# EAGLE design rpi (EAGLE 6.4)
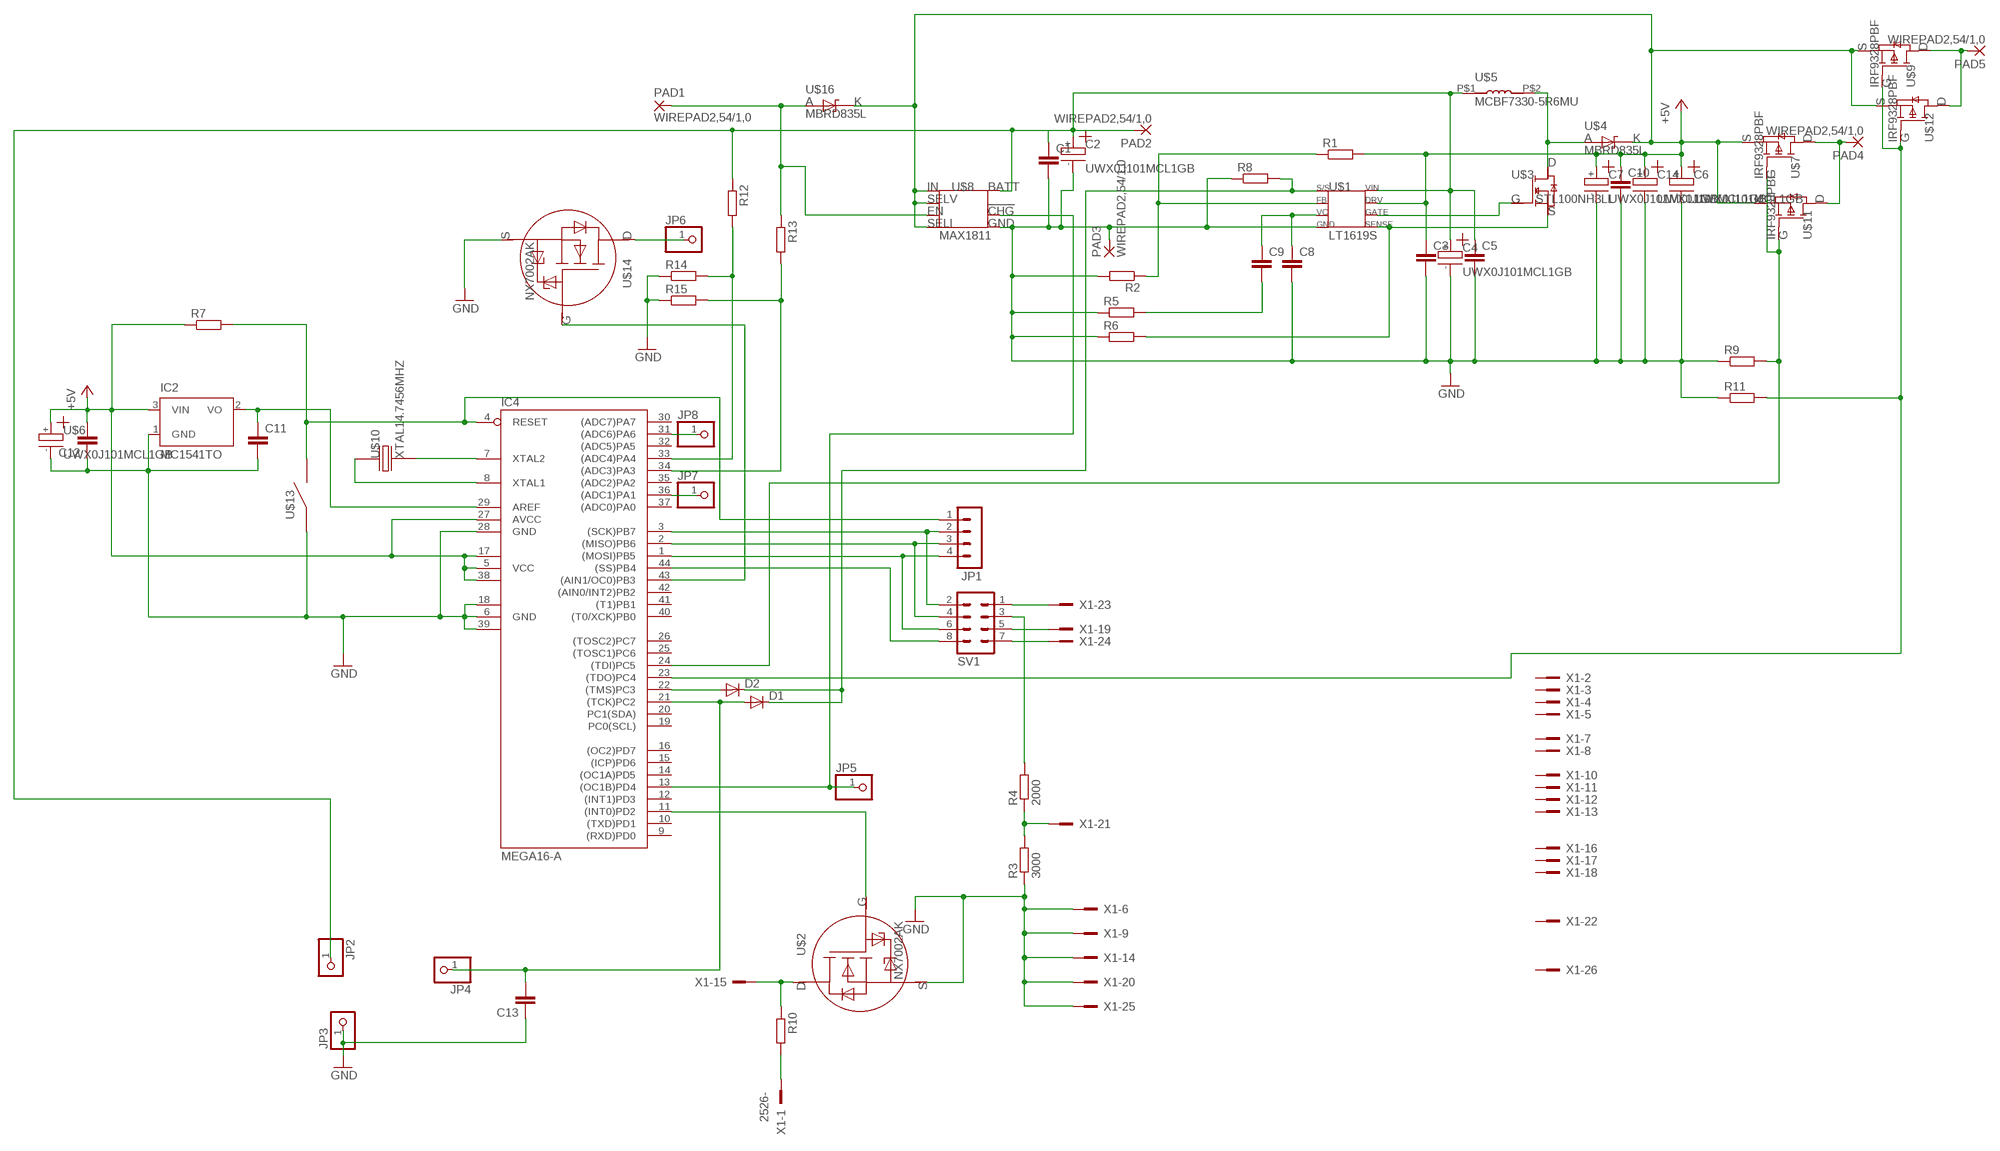
[diagram p0: schematic, sheet 1]

## Parts
C1  C-EUC1206  [C1206]
C2  UWX0J101MCL1GB  [UWX0J101MCL1GB]
C3  C-EUC1206  [C1206]
C4  UWX0J101MCL1GB  [UWX0J101MCL1GB]
C5  C-EUC1206  [C1206]
C6  UWX0J101MCL1GB  [UWX0J101MCL1GB]
C7  UWX0J101MCL1GB  [UWX0J101MCL1GB]
C8  C-EUC1206  [C1206]
C9  C-EUC1206  [C1206]
C10  C-EUC1206  [C1206]
C11  C-EUC1206  [C1206]
C12  C-EUC1206  [C1206]
C13  C-EUC1206  [C1206]
C14  UWX0J101MCL1GB  [UWX0J101MCL1GB]
D1  DIODE-MINIMELF  [MINIMELF]
D2  DIODE-MINIMELF  [MINIMELF]
IC2  MC1541TO  [TO92]
IC4  MEGA16-A  [TQFP44]
JP1  MA04-1  [MA04-1]
JP2  PINHD-1X1  [1X01]
JP3  PINHD-1X1  [1X01]
JP4  PINHD-1X1  [1X01]
JP5  PINHD-1X1  [1X01]
JP6  PINHD-1X1  [1X01]
JP7  PINHD-1X1  [1X01]
JP8  PINHD-1X1  [1X01]
PAD1  WIREPAD2,54/1,0  [2,54/1,0]
PAD2  WIREPAD2,54/1,0  [2,54/1,0]
PAD3  WIREPAD2,54/1,0  [2,54/1,0]
PAD4  WIREPAD2,54/1,0  [2,54/1,0]
PAD5  WIREPAD2,54/1,0  [2,54/1,0]
R1  R-EU_R1206  [R1206]
R2  R-EU_R1206  [R1206]
R3  3000  R-EU_R1206  [R1206]
R4  2000  R-EU_R1206  [R1206]
R5  R-EU_R1206  [R1206]
R6  R-EU_R1206  [R1206]
R7  R-EU_R1206  [R1206]
R8  R-EU_R1206  [R1206]
R9  R-EU_R1206  [R1206]
R10  R-EU_R1206  [R1206]
R11  R-EU_R1206  [R1206]
R12  R-EU_R1206  [R1206]
R13  R-EU_R1206  [R1206]
R14  R-EU_R1206  [R1206]
R15  R-EU_R1206  [R1206]
SV1  MA04-2  [MA04-2]
U$1  LT1619S  [SO8]
U$2  NX7002AK  [SOT23]
U$3  STL100NH3LL  [POWERFLAT6X5]
U$4  MBRD835L  [DPAK]
U$5  MCBF7330-5R6MU  [MCBF7330-5R6MU]
U$6  UWX0J101MCL1GB  [UWX0J101MCL1GB]
U$7  IRF9328PBF  [SO8]
U$8  MAX1811  [SO8]
U$9  IRF9328PBF  [SO8]
U$10  XTAL14.7456MHZ  [HC49-SMD]
U$11  IRF9328PBF  [SO8]
U$12  IRF9328PBF  [SO8]
U$13  TLACITKO  [TLACITKO]
U$14  NX7002AK  [SOT23]
U$16  MBRD835L  [DPAK]
X1  2526-  [PAK100/2500-26]

## Nets
+5V: C3.1 C6.+ C7.+ C10.1 C12.2 C14.+ IC2.3(VIN) IC4.5(VCC) IC4.17(VCC1) IC4.27(AVCC) IC4.38(VCC2) R1.2 R7.1 U$1.D2(DRV) U$4.4(K) U$6.+ U$7.S U$7.S2(S) U$7.S3(S) U$8.G(IN) U$8.S2(SELI) U$8.S(SELV) U$9.S U$9.S2(S) U$9.S3(S) U$11.S U$11.S2(S) U$11.S3(S) U$12.S U$12.S2(S) U$12.S3(S) U$16.4(K)
AREF: C11.1 IC2.2(VO) IC4.29(AREF)
GND: C1.2 C2.- C3.2 C4.- C5.2 C6.- C7.- C8.2 C10.2 C11.2 C12.1 C13.1 C14.- IC2.1(GND) IC4.6(GND) IC4.18(GND1) IC4.28(GND) IC4.39(GND2) JP3.1 PAD3.1(P) R2.2 R3.1 R5.1 R6.1 R8.1 R9.1 R11.1 R14.1 R15.1 U$1.G(GND) U$2.S U$6.- U$8.D3(GND) U$8.S3(GND) U$13.P$1 U$13.P$3 U$14.S X1.6 X1.9 X1.14 X1.20 X1.25
N$1: R3.2 R4.1 X1.21
N$2: IC4.34((ADC3)PA3) R13.2 R15.2
N$3: D2.A IC4.22((TMS)PC3)
N$4: R4.2 SV1.3
N$5: SV1.7 X1.24
N$6: IC4.11((INT0)PD2) U$2.G
N$7: R10.2 X1.1
N$8: R10.1 U$2.D X1.15
N$9: IC4.43((AIN1/OC0)PB3) U$14.G
N$10: JP6.1 U$14.D
N$11: IC4.36((ADC1)PA1) JP7.1
N$12: R1.1 R2.1 U$1.S2(FB)
N$13: R6.2 U$1.D4(SENSE) U$3.1(S) U$3.2(S) U$3.3(S)
N$14: IC4.31((ADC6)PA6) JP8.1
N$15: IC4.24((TDI)PC5) R9.2 U$7.G U$11.G
N$16: IC4.33((ADC4)PA4) R12.2 R14.2
N$17: PAD1.1(P) R13.1 U$8.D2(EN) U$16.1(A) U$16.3(A)
N$18: U$1.D3(GATE) U$3.4(G)
N$19: C13.2 D1.A IC4.21((TCK)PC2) JP4.1
N$20: PAD4.1(P) U$7.D U$7.D2(D) U$7.D3(D) U$7.D4(D) U$11.D U$11.D2(D) U$11.D3(D) U$11.D4(D)
N$21: SV1.5 X1.19
N$22: SV1.1 X1.23
N$23: U$3.5(D) U$4.1(A) U$4.3(A) U$5.P$2
N$25: C9.2 R5.2
N$26: C8.1 C9.1 U$1.S3(VC)
N$29: PAD5.1(P) U$9.D U$9.D2(D) U$9.D3(D) U$9.D4(D) U$12.D U$12.D2(D) U$12.D3(D) U$12.D4(D)
PA3: C1.1 C2.+ C4.+ C5.1 JP2.1 PAD2.1(P) R12.1 U$1.D(VIN) U$5.P$1 U$8.D4(BATT)
PB4: IC4.44((SS)PB4) SV1.8
PB5: IC4.1((MOSI)PB5) JP1.4 SV1.6
PB6: IC4.2((MISO)PB6) JP1.3 SV1.4
PC3: D1.C D2.C R8.2 U$1.S(S/S)
PC4: IC4.23((TDO)PC4) R11.2 U$9.G U$12.G
PD5: IC4.13((OC1B)PD4) JP5.1 U$8.D(!CHG)
RESET: IC4.4(RESET) JP1.1 R7.2 U$13.P$2 U$13.P$4
SCK: IC4.3((SCK)PB7) JP1.2 SV1.2
XTAL1: IC4.8(XTAL1) U$10.P$1
XTAL2: IC4.7(XTAL2) U$10.P$2
Unconnected: IC4.9((RXD)PD0) IC4.10((TXD)PD1) IC4.12((INT1)PD3) IC4.14((OC1A)PD5) IC4.15((ICP)PD6) IC4.16((OC2)PD7) IC4.19(PC0(SCL)) IC4.20(PC1(SDA)) IC4.25((TOSC1)PC6) IC4.26((TOSC2)PC7) IC4.30((ADC7)PA7) IC4.32((ADC5)PA5) IC4.35((ADC2)PA2) IC4.37((ADC0)PA0) IC4.40((T0/XCK)PB0) IC4.41((T1)PB1) IC4.42((AIN0/INT2)PB2) X1.2 X1.3 X1.4 X1.5 X1.7 X1.8 X1.10 X1.11 X1.12 X1.13 X1.16 X1.17 X1.18 X1.22 X1.26

## Library data of the parts
C1 C3 C5 C8-C13 = rcl:C-EU: CAPACITOR, European symbol
C2 C4 C6 C7 C14 U$6 = tablet:UWX0J101MCL1GB
D1 D2 = diode:DIODE-: DIODE
IC2 = microchip:MC15*: 2.5V and 4.096V Voltage References Source: http://www.microchip.com .. 21653b.pdf; OC_FARNELL: unknown; OC_NEWARK: unknown
IC4 = atmel:MEGA16: MICROCONTROLLER 16 Kbytes FLASH 1 kbytes SRAM 512 bytes EEPROM USART 8-channel 10 bit ADC Source: avr.lbr; MPN: ATMEGA16-16AU; OC_FARNELL: 9171134; OC_NEWARK: 96K6515
JP1 = tablet:MA04-1: PIN HEADER; OC_FARNELL: unknown; OC_NEWARK: unknown
JP2-JP8 = pinhead:PINHD-1X1: PIN HEADER
PAD1-PAD5 = wirepad:WIREPAD: Wire PAD connect wire on PCB
R1 R2 R5-R15 = rcl:R-EU_: RESISTOR, European symbol
R3 R4 = resistor:R-EU_: RESISTOR, European symbol
SV1 = tablet:MA04-2: PIN HEADER; OC_FARNELL: unknown; OC_NEWARK: unknown
U$1 = tablet:LT1619
U$2 U$14 = tablet:NX7002AK
U$3 = tablet:STL100NH3LL
U$4 U$16 = tablet:MBRD835L
U$5 = tablet:MCBF7330-5R6MU
U$7 U$9 U$11 U$12 = tablet:IRF9328PBF
U$8 = tablet:MAX1811
U$10 = tablet:XTAL14.7456MHZ
U$13 = tablet:TLACITKO
X1 = tablet:2526-: 3M (TM) Pak 100 4-Wall Header Source: 3M; OC_FARNELL: unknown; OC_NEWARK: unknown

## Net classes
0 default: clearance 0.355 mm

## Board
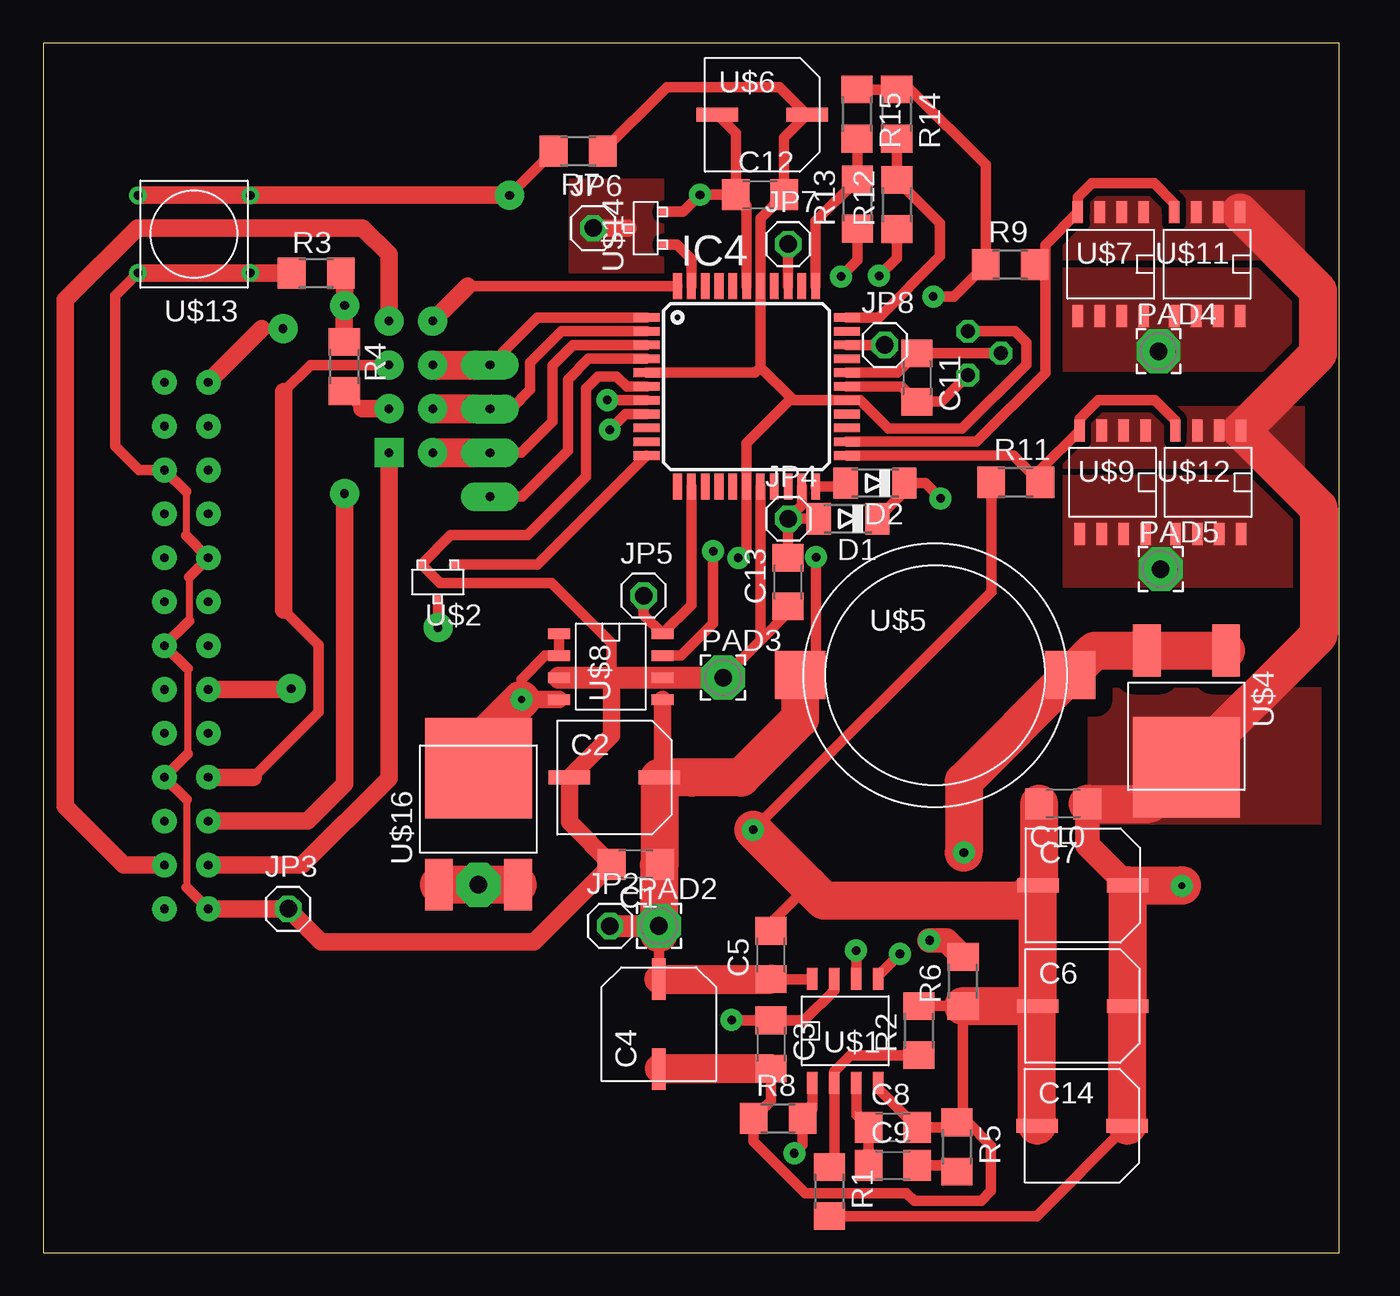
[diagram p1: board, top side]
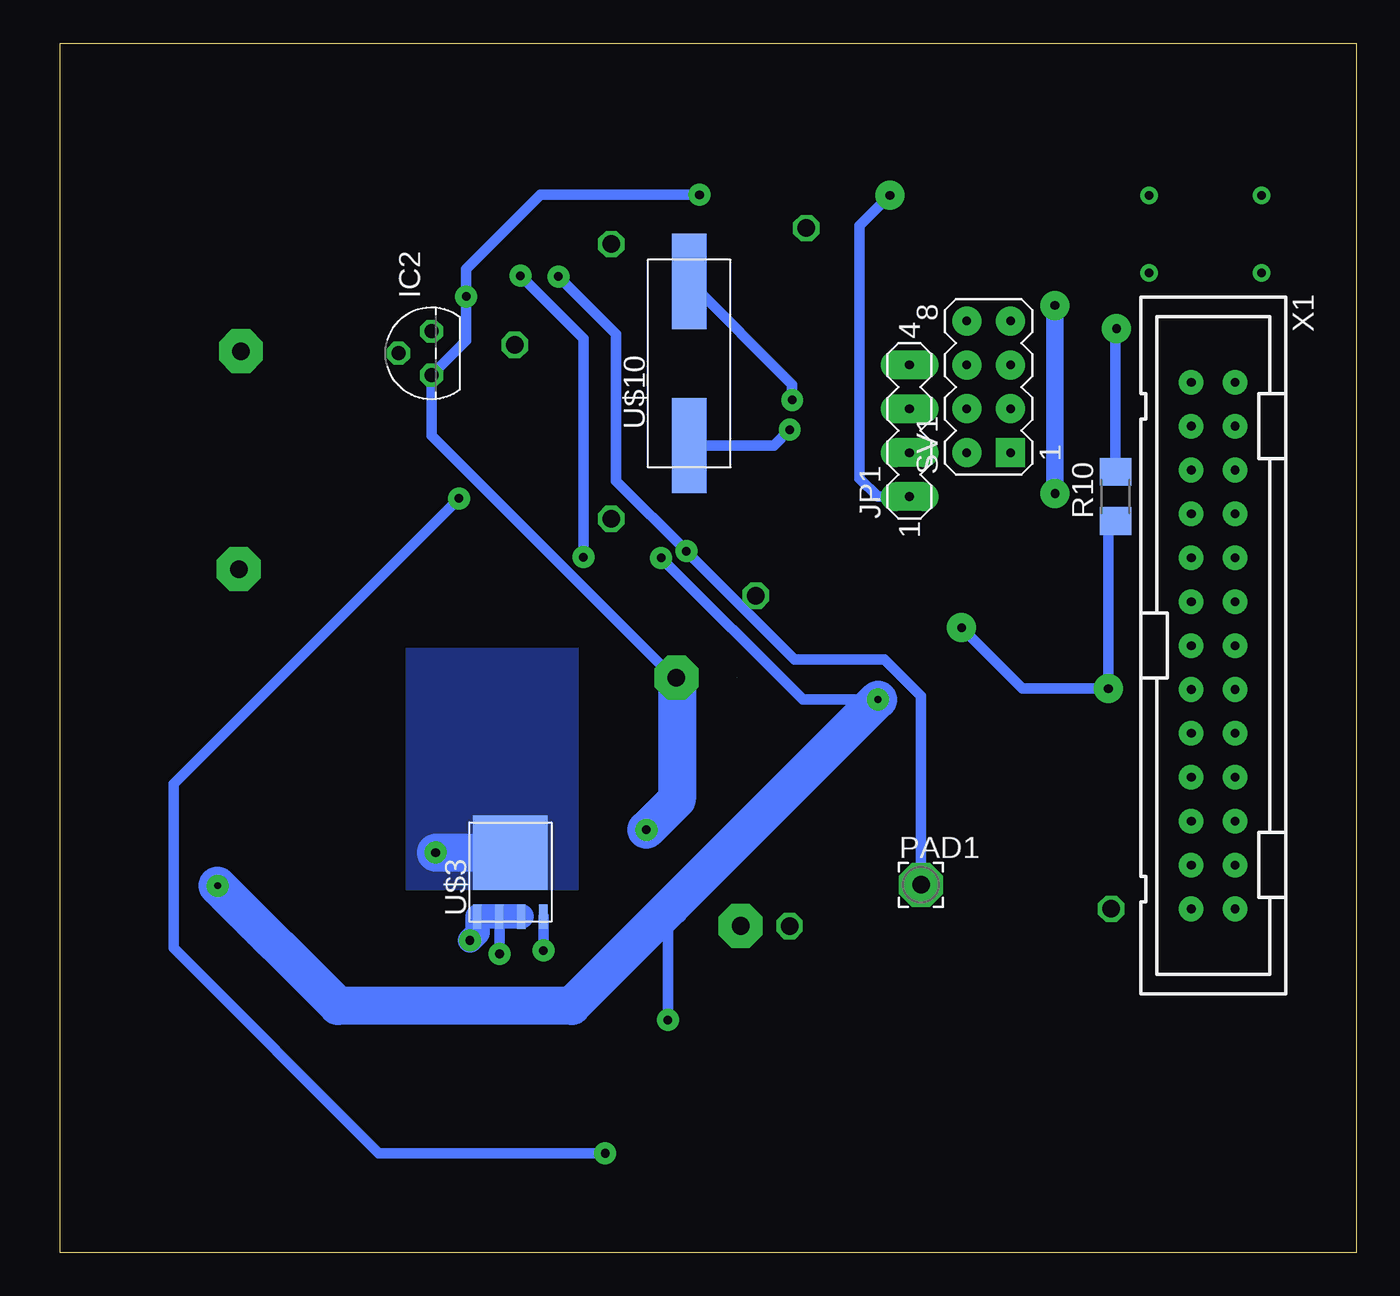
[diagram p2: board, bottom side, seen from below]

Size 75 x 70 mm. Coordinates in mm from the lower left corner, seen from the top.
Outline: 0,0 75,0 75,70 0,70 0,0
Copper layers (1*16): Top 0.035mm / dielectric 1.5mm / Bottom 0.035mm
Design rules "default *": minimum track width 10mil, minimum drill 24mil, track to track 10mil, track to pad 10mil, pad to pad 10mil, via to via 10mil, smd to smd 8mil, copper to edge 40mil, drill to drill 8mil, minimum pad ring 10mil, minimum via ring 8mil, stop-mask expansion 4mil, vias tented up to drill 0mil, thermal gap 10mil

### Footprints (pad centres in the part's own frame; a part is rotated, then mirrored left to right if it is on the bottom)
C1206 = smd 1.6 x 1.8: 1 -1.4,0; 2 1.4,0
UWX0J101MCL1GB = smd 0.8 x 2.4: + 0,2.6; - 0,-2.6
MINIMELF = smd 1.4 x 1.8: A 1.7,0; C -1.7,0
TO92 = drill 0.813 octagon: 1 -1.27,0; 2 0,1.905; 3 1.27,0
TQFP44 = smd 1.5 x 0.5: 1 -5.8,4; 2 -5.8,3.2; 3 -5.8,2.4; 4 -5.8,1.6; 5 -5.8,0.8; 6 -5.8,0; 7 -5.8,-0.8; 8 -5.8,-1.6; 9 -5.8,-2.4; 10 -5.8,-3.2; 11 -5.8,-4; 23 5.8,-4; 24 5.8,-3.2; 25 5.8,-2.4; 26 5.8,-1.6; 27 5.8,-0.8; 28 5.8,0; 29 5.8,0.8; 30 5.8,1.6; 31 5.8,2.4; 32 5.8,3.2; 33 5.8,4 | smd 0.5 x 1.5: 12 -4,-5.8; 13 -3.2,-5.8; 14 -2.4,-5.8; 15 -1.6,-5.8; 16 -0.8,-5.8; 17 0,-5.8; 18 0.8,-5.8; 19 1.6,-5.8; 20 2.4,-5.8; 21 3.2,-5.8; 22 4,-5.8; 34 4,5.8; 35 3.2,5.8; 36 2.4,5.8; 37 1.6,5.8; 38 0.8,5.8; 39 0,5.8; 40 -0.8,5.8; 41 -1.6,5.8; 42 -2.4,5.8; 43 -3.2,5.8; 44 -4,5.8
MA04-1 = drill 0.5 pad 1.676 long: 1 -3.81,0; 2 -1.27,0; 3 1.27,0; 4 3.81,0
1X01 = drill 1.016 octagon: 1 0,0
2,54/1,0 = drill 1.016 pad 2.54 octagon: 1 0,0
R1206 = smd 1.6 x 1.803: 1 -1.422,0; 2 1.422,0
MA04-2 = drill 0.5 pad 1.676 square: 1 -3.81,-1.27 | drill 0.5 pad 1.676: 2 -3.81,1.27; 3 -1.27,-1.27; 4 -1.27,1.27; 5 1.27,-1.27; 6 1.27,1.27; 7 3.81,-1.27; 8 3.81,1.27
SO8 = smd 0.6 x 1.27: D -1.905,3; D2 -0.635,3; D3 0.635,3; D4 1.905,3; G 1.905,-3; S -1.905,-3; S2 -0.635,-3; S3 0.635,-3
SOT23 = smd 0.48 x 0.45: D 0,1.025; G -0.95,-1.025; S 0.95,-1.025
POWERFLAT6X5 = smd 0.495 x 1.4: 1 -1.905,-2.575; 2 -0.635,-2.575; 3 0.635,-2.575; 4 1.905,-2.575 | smd 4.305 x 4.3: 5 0,1.125
DPAK = smd 1.6 x 3: 1 -2.29,-4.96; 3 2.29,-4.96 | smd 6.2 x 5.8: 4 0,1.78
MCBF7330-5R6MU = smd 2.92 x 2.79: P$1 -7.81,0; P$2 7.81,0
HC49-SMD = smd 5.5 x 2: P$1 -4.75,0; P$2 4.75,0
TLACITKO = drill 0.5: P$1 -3.25,2.25; P$2 -3.25,-2.25; P$3 3.25,2.25; P$4 3.25,-2.25
PAK100/2500-26 = drill 0.5 pad 1.422: 1 -15.24,-1.27; 2 -15.24,1.27; 3 -12.7,-1.27; 4 -12.7,1.27; 5 -10.16,-1.27; 6 -10.16,1.27; 7 -7.62,-1.27; 8 -7.62,1.27; 9 -5.08,-1.27; 10 -5.08,1.27; 11 -2.54,-1.27; 12 -2.54,1.27; 13 0,-1.27; 14 0,1.27; 15 2.54,-1.27; 16 2.54,1.27; 17 5.08,-1.27; 18 5.08,1.27; 19 7.62,-1.27; 20 7.62,1.27; 21 10.16,-1.27; 22 10.16,1.27; 23 12.7,-1.27; 24 12.7,1.27; 25 15.24,-1.27; 26 15.24,1.27

### Placement (x,y rotation side)
C1  34.3,22.48 180 top
C2  33.06,27.5 270 top
C3  42.12,12.05 270 top
C4  35.63,13.22 0 top
C5  42.12,17.23 90 top
C6  60.15,14.27 270 top
C7  60.17,21.26 270 top
C8  49.17,7.26 0 top
C9  49.17,5.06 0 top
C10  59.04,25.98 180 top
C11  50.56,50.65 270 top
C12  41.49,61.23 0 top
C13  43.11,38.81 90 top
C14  60.12,7.34 270 top
D1  46.58,42.48 180 top
D2  48.14,44.54 180 top
IC2  53.52,52.05 90 bottom
IC4  40.71,50.13 0 top
JP1  25.86,47.57 90 bottom
JP2  32.8,18.9 0 top
JP3  14.18,19.9 0 top
JP4  43.12,42.47 0 top
JP5  34.76,38.02 0 top
JP6  31.83,59.3 0 top
JP7  43.12,58.37 0 top
JP8  48.71,52.53 0 top
PAD1  25.19,21.29 0 bottom
PAD2  35.64,18.91 0 top
PAD3  39.35,33.28 0 top
PAD4  64.55,52.17 0 top
PAD5  64.67,39.56 0 top
R1  45.5,3.54 270 top
R2  50.68,12.86 90 top
R3  15.8,56.69 0 top
R4  17.43,51.28 270 top
R5  52.88,6.12 270 top
R6  53.24,15.7 90 top
R7  30.96,63.75 180 top
R8  42.53,7.78 0 top
R9  55.97,57.18 0 top
R10  13.94,43.76 90 bottom
R11  56.29,44.58 0 top
R12  49.4,60.66 90 top
R13  47.12,60.69 90 top
R14  49.4,65.89 270 top
R15  47.1,65.9 270 top
SV1  21.28,50.11 90 bottom
U$1  46.42,12.84 0 top
U$2  22.84,38.81 180 top
U$3  48.96,22.03 0 bottom
U$4  66.16,29.88 180 top
U$5  51.62,33.43 0 top
U$6  41.61,65.85 270 top
U$7  61.78,57.21 180 top
U$8  32.85,33.92 270 top
U$9  61.89,44.58 180 top
U$10  38.61,51.47 90 bottom
U$11  67.35,57.21 180 top
U$12  67.43,44.59 180 top
U$13  8.73,58.95 180 top
U$14  34.88,59.29 90 top
U$16  25.19,26.26 0 top
X1  8.28,35.14 270 bottom

### Tracks (layer width: path | path; a pad name or v marks a point on that pad's centre or on a via)
+5V  (via drill 0.4 pad 1.27, 0.5 pad 1.27)
  Top 0.61: v27.67,32.01 27.67,33.18 29.05,34.55 U$8.S2 U$8.S | 27.68,32.01 27.7,32.01 | 41.51,51.23 IC4.38 41.51,59.85 C12.2 42.88,64.52 U$6.+ 42.61,67.46 36.09,67.46 R7.1 | 41.51,51.23 43.29,49.45 | 43.29,49.45 43.41,49.33 IC4.27 47.27,49.33 48.91,47.69 53.18,47.69 56.89,51.41 56.89,52.68 56.24,53.32 IC2.3 | 43.29,49.45 40.71,46.86 IC4.17 40.71,40.69 v40.23,40.21 | IC4.5 41.21,50.93 41.51,51.23 | U$1.D2 45.78,15.19 44.04,13.45 C3.1 39.86,13.45 v39.84,13.46 | R1.2 57.5,2.12 C14.+
  Top 1.016: U$8.G 27.7,32.01 v27.67,32.01
  Top 1.422: C10.1 60.44,23.59 62.75,21.28 62.75,21.26
  Top 2.184: 62.77,14.29 C6.+ | C10.1 64.04,25.98 U$4.4 73.81,35.75 73.81,43.11 U$12.S 73.79,52.04 73.79,55.68 U$11.S | 65.88,21.26 v65.9,21.24 65.9,21.26 C7.+ 62.75,21.26 C6.+ | U$16.4 25.19,29.53 v27.67,32.01 | C14.+ 62.75,7.34 C6.+
  Bottom 0.61: v40.23,40.21 32.03,32.01 v27.67,32.01 | v39.84,13.46 39.84,19.85 39.68,20.01
  Bottom 2.184: v27.67,32.01 39.68,20.01 45.42,14.27 58.93,14.27 v65.9,21.24
  pour Top (isolate 1.016, no thermals): 60.52,32.71 74.29,32.71 74.29,27.9 74.29,24.78 61.22,24.78 60.46,24.78 60.46,32.71
  pour Top (isolate 0.406, rank 2, no thermals): 59,61.5 73,61.5 73,57 59,57
  pour Top (rank 2, no thermals): 59,45 73,45 73,49 59,49
AREF
  Top 0.61: IC4.29 49.44,50.93 C11.1 IC2.2
GND  (via drill 0.5 pad 1.27)  (1 unrouted)
  Top 0.406: 8.26,44.05 8.26,41.51 | 8.44,39.1 8.44,36.56 | 8.35,33.8 8.35,28.85 | 8.3,26.22 8.3,21.14
  Top 0.61: IC4.39 40.71,60.6 C12.1 | C12.1 40.09,64.78 U$6.- | IC4.28 49.68,50.13 C11.2 51.99,49.25 IC2.1 | 32.9,33.28 32.9,35.28 29.43,38.74 22.98,38.74 U$2.S 23.58,41.53 28.04,41.53 31.42,44.91 31.42,50.01 32.12,50.71 33.19,50.71 33.77,50.13 IC4.6 | IC4.18 41.51,35.44 | 41.51,35.44 PAD3.1 | R11.1 54.86,38.25 v41.09,24.47 | C12.1 v38.02,61.23 v38.01,61.22 37.03,60.23 U$14.S | R15.1 R14.1 50.19,67.31 54.55,62.96 R9.1 52.7,55.34 v51.51,55.34 | C13.1 43.11,37.04 41.51,35.44 | U$1.G 48.32,9.52 C8.2 52.6,7.26 R5.1 | R2.2 R6.1 53.24,7.9 R5.1 | C6.- | C5.2 42.12,19.08 43.82,20.78 | 35.65,10.65 C4.- | C3.2 42.12,8.79 R8.1 41.11,6.45 44.12,3.45 49.97,3.45 50.42,3 54.28,3 54.86,3.57 54.86,6.2 53.51,7.54 R5.1 | X1.25 8.3,21.14 | U$13.P$1 11.99,56.69 | 8.26,44.05 X1.6 5.56,45.3 4.17,46.68 4.17,55.39 U$13.P$3 | 8.26,41.51 X1.9 8.44,39.1 | 8.44,36.56 X1.14 8.35,33.8 | 8.35,28.85 X1.20 8.3,26.22
  Top 1.016: U$8.D3 U$8.S3 32.9,33.28 32.9,29.94 C2.- 30.46,24.92 C1.2 28.41,17.99 16.09,17.99 JP3.1 X1.25 | v39.33,33.28 PAD3.1 | 43.82,20.78 44.3,21.26 | 11.99,56.69 R3.1 | U$13.P$1 U$13.P$3
  Top 1.27: U$8.S3 U$8.D3 v39.33,33.28
  Top 1.676: C3.2 35.65,10.65
  Top 2.184: v41.09,24.47 44.3,21.26 45.19,20.37 56.68,20.37 C7.- | R6.1 C6.- | C14.- 57.52,14.25 C6.- 57.57,14.29 C7.- | C10.2 57.63,21.32 C7.-
  Bottom 0.61: v38.01,61.22 47.21,61.22 51.51,56.92 v51.51,55.34 51.51,52.8 IC2.1 53.52,47.3 39.51,33.28 PAD3.1
  Bottom 2.184: v39.33,33.28 39.33,26.23 v41.09,24.47
  other vias: 39.35,33.28
N$1  (via drill 0.5 pad 1.68)
  Top 1.016: X1.21 15.3,24.98 17.44,27.12 v17.44,43.94 | R3.2 17.45,56.47 v17.45,54.82 17.43,54.8 R4.1
  Bottom 1.016: v17.44,43.94 17.44,54.81 v17.45,54.82
N$2
  Top 0.61: IC4.34 44.71,59.7 R13.2 47.12,64.46 R15.2
N$3
  Top 0.61: IC4.22 46.23,44.33 D2.A
N$4
  Top 0.61: 18.45,48.84 R4.2
  Top 1.016: SV1.3 18.45,48.84
N$5
  Top 1.016: SV1.7 20.01,57.8 18.5,59.31 5.44,59.31 1.28,55.15 1.28,25.81 4.66,22.44 X1.24
N$6
  Top 0.61: U$2.G 28.61,39.84 IC4.11
N$7  (via drill 0.5 pad 1.68)
  Top 0.61: v13.88,53.48 12.66,53.48
  Top 1.016: 12.66,53.48 X1.1
  Bottom 0.61: R10.2 13.94,53.43 v13.88,53.48
N$8  (via drill 0.5 pad 1.68)
  Top 0.61: 14.3,32.6 v14.35,32.64 | v22.84,36.17 U$2.D
  Top 1.016: X1.15 14.3,32.6
  Bottom 0.61: v22.84,36.17 19.32,32.64 v14.35,32.64 14.35,41.93 R10.1
N$9
  Top 0.61: IC4.43 37.51,57.51 36.69,58.34 U$14.G
N$10
  Top 0.61: 33.84,59.3 U$14.D
  Top 1.016: JP6.1 33.84,59.3
  pour Top (no thermals): 30.44,62.16 30.44,56.68 35.92,56.68 35.92,62.16
N$11
  Top 0.61: IC4.36 43.11,58.36 JP7.1
N$12
  Top 0.61: R2.1 46.72,11.43 45.78,10.5 U$1.S2 45.78,5.25 R1.1
N$13  (via drill 0.5 pad 1.27)
  Top 0.61: U$1.D4 48.32,16.03 v49.59,17.29
  Top 1.422: v51.3,18.08 52.28,18.08 R6.2
  Bottom 0.61: v49.59,17.29 U$3.2
  Bottom 1.422: U$3.3 U$3.2 U$3.1 50.86,18.52 v51.3,18.08
N$14
  Top 0.61: IC4.31 JP8.1 | JP8.1
N$15
  Top 0.61: R9.2 57.99,57.19 | IC4.24 54.01,46.93 57.99,50.91 57.99,57.19 | 57.99,57.19 57.99,58.32 U$7.G 59.88,61.08 60.69,61.89 64.29,61.89 65.45,60.73 U$11.G
N$16
  Top 0.61: R14.2 49.4,62.09 R12.2 51.9,59.59 51.9,57.67 48.36,54.13 IC4.33
N$17  (via drill 0.5 pad 1.27)
  Top 0.61: R13.1 47.12,57.43 v46.18,56.49 | U$8.D2 36.91,34.55 38.77,36.42 v38.77,40.6
  Top 2.184: U$16.3 PAD1.1 U$16.1
  Bottom 0.61: v46.18,56.49 42.84,53.15 42.84,44.66 v38.77,40.6 38.39,40.22 32.52,34.34 27.31,34.34 25.2,32.23 PAD1.1
N$18  (via drill 0.5 pad 1.27)
  Top 0.61: U$1.D3 v47.05,17.48 v47.05,17.49
  Bottom 0.61: v47.05,17.49 U$3.4
N$19
  Top 0.61: C13.2 JP4.1 | JP4.1 | IC4.21 43.91,43.26 JP4.1 | D1.A JP4.1
N$20
  pour Top (isolate 0.406, no thermals): 59,57 73,57 73,51 59,51
N$21
  Top 0.61: SV1.5 15.48,51.38 13.92,49.83 | 12.16,27.52 15.94,31.29 15.94,35.17 13.92,37.19
  Top 1.016: 12.16,27.52 X1.19 | 13.92,37.19 13.92,49.83
N$22
  Top 1.016: SV1.1 20.01,27.46 14.99,22.44 X1.23
N$23  (via drill 0.5 pad 1.27)
  Top 2.184: U$4.1 U$4.3 60.84,34.84 U$5.P$2 53.28,27.28 v53.28,23.15
  Bottom 2.184: v53.28,23.15 U$3.5
  pour Bottom (isolate 0.406, no thermals): 55,21 55,35 45,35 45,21
N$25
  Top 0.61: C9.2 52.52,5.06 R5.2
N$26
  Top 0.61: U$1.S3 47.05,7.99 C8.1 C9.1
N$29
  pour Top (isolate 0.406, no thermals): 59,45 73,45 73,38.5 59,38.5
PA3  (via drill 0.5 pad 1.27)
  Top 0.61: R12.1 49.4,57.57 v48.37,56.54 | v44.73,40.25 v44.73,40.26 44.73,34.35 U$5.P$1 | U$1.D 44.5,15.83 C5.1 | 35.64,18.48 35.64,15.83 C4.+
  Top 1.016: U$8.D4 35.85,27.69 C2.+ | 35.66,22.52 C1.1
  Top 1.27: JP2.1 PAD2.1
  Top 1.676: C4.+ C5.1
  Top 2.184: 35.66,22.52 C2.+ 37.53,27.5 40.39,27.5 43.81,30.92 U$5.P$1 | C1.1 35.64,22.42 PAD2.1 35.64,18.48
  Bottom 0.61: v48.37,56.54 44.73,52.9 v44.73,40.26
PB4
  Top 0.61: IC4.44 24.56,55.93
  Top 1.016: 24.56,55.93 SV1.8
PB5
  Top 0.61: IC4.1 28.61,54.13 JP1.4
  Top 1.676: SV1.6 JP1.4
PB6
  Top 0.61: JP1.3 27.09,48.84 28.19,49.94 28.19,51.52 30,53.33 IC4.2
  Top 1.676: SV1.4 JP1.3
PC3  (via drill 0.5 pad 1.27)
  Top 0.61: U$1.S 44.51,8.34 R8.2 43.96,6.23 v43.48,5.75 | v51.94,43.66 51.05,44.54 D2.C 49.84,44.04 D1.C
  Bottom 0.61: v43.48,5.75 56.57,5.75 68.46,17.63 68.46,27.13 v51.94,43.66
PC4
  Top 0.61: IC4.23 56.16,46.13 R11.2 57.71,45.31 U$9.G 59.98,48.26 61.07,49.35 64.34,49.35 65.52,48.16 U$12.G
PD5
  Top 0.61: IC4.13 37.51,37.48 U$8.D 34.76,36.92 JP5.1
RESET  (via drill 0.5 pad 1.68)
  Top 0.61: JP1.1 27.7,43.76 30.37,46.43 30.37,50.54 31.57,51.73 IC4.4 | v26.99,61.2 R7.2
  Top 1.016: U$13.P$4 U$13.P$2 v26.99,61.2
  Bottom 0.61: JP1.1 27.69,43.76 28.75,44.81 28.75,59.45 v26.99,61.2
SCK
  Top 0.61: IC4.3 30.68,52.53 29.48,51.33 29.48,48.1 27.67,46.3 JP1.2
  Top 1.676: SV1.2 JP1.2
XTAL1  (via drill 0.5 pad 1.27)
  Top 0.61: IC4.8 33.69,48.53 v32.79,47.63
  Bottom 0.61: v32.79,47.63 33.7,46.72 U$10.P$1
XTAL2  (via drill 0.5 pad 1.27)
  Top 0.61: IC4.7 32.67,49.33 v32.65,49.35
  Bottom 0.61: v32.65,49.35 32.65,50.25 U$10.P$2